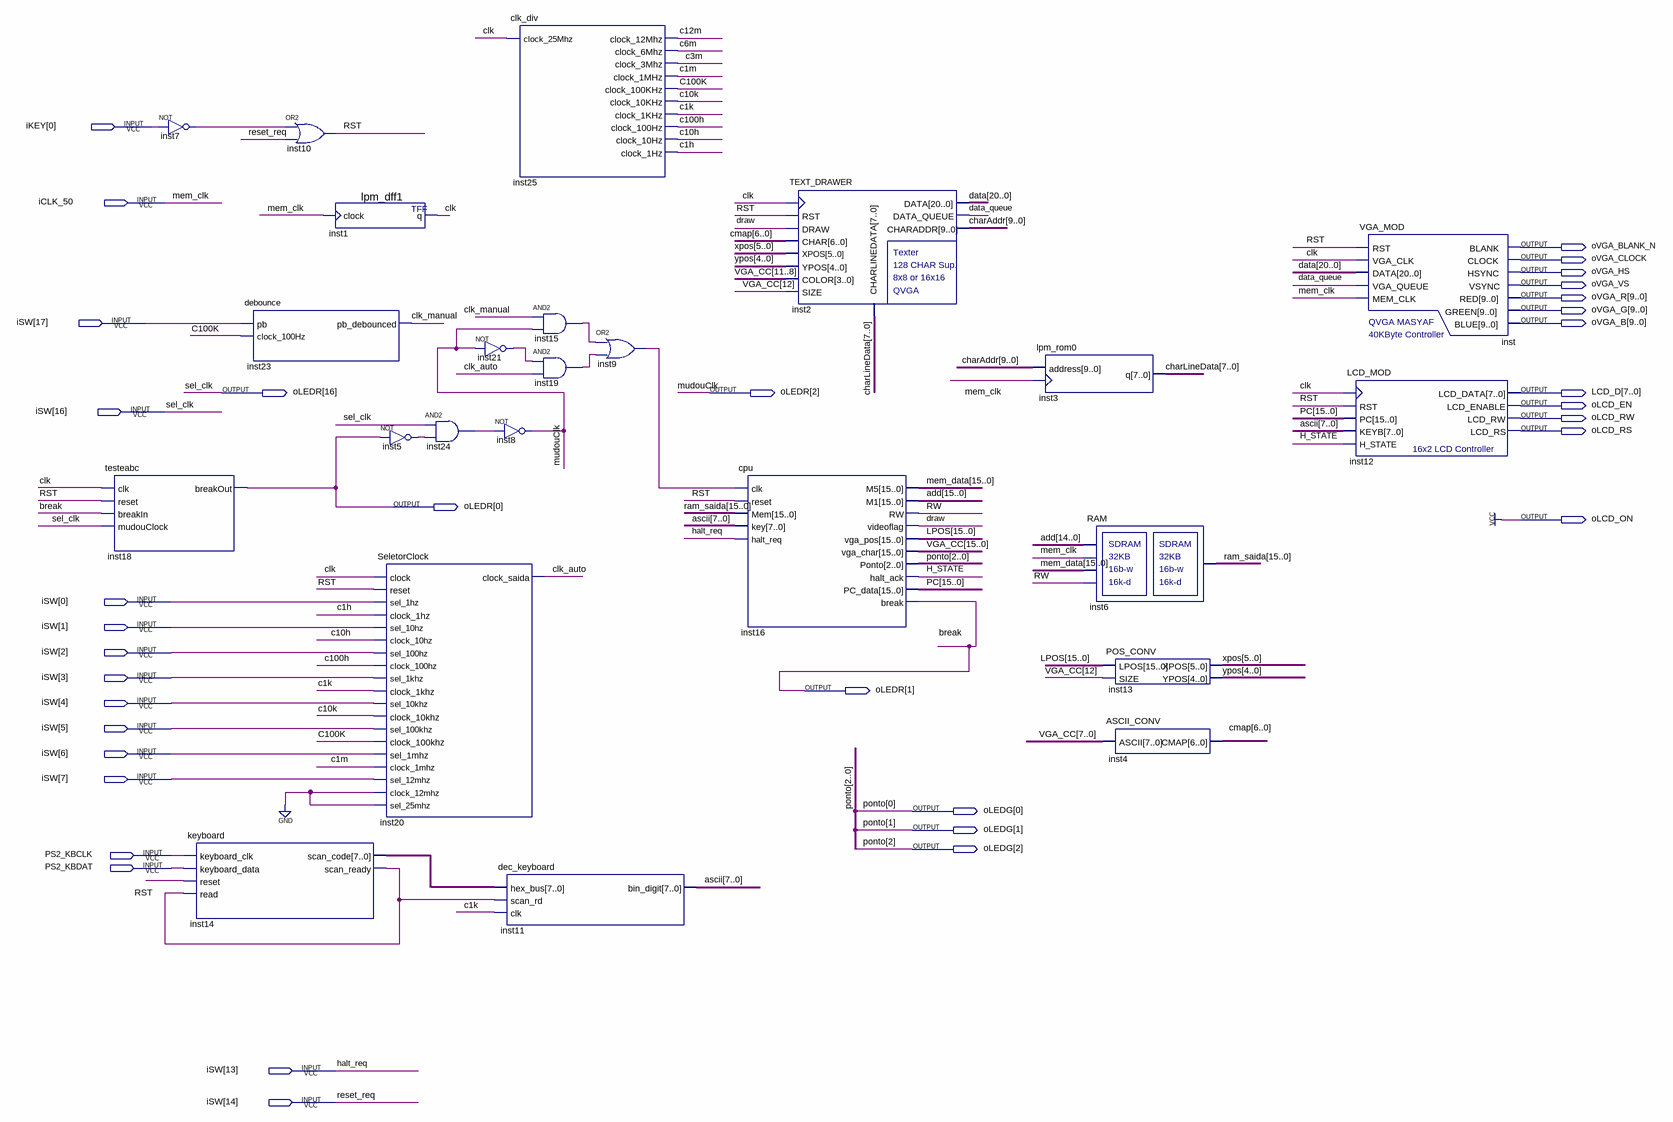
[diagram p0: schematic sheet]
// Quartus schematic AP9.bdf as structural Verilog: 24 symbols, 35 pins
module AP9 (
  input  [0:0] iKEY,
  input  iCLK_50,
  input  [17:0] iSW,
  input  PS2_KBCLK,
  input  PS2_KBDAT,
  output oVGA_BLANK_N,
  output oVGA_CLOCK,
  output oVGA_HS,
  output oVGA_VS,
  output [9:0] oVGA_R,
  output [9:0] oVGA_G,
  output [9:0] oVGA_B,
  output [16:0] oLEDR,
  output [7:0] LCD_D,
  output oLCD_EN,
  output oLCD_RW,
  output oLCD_RS,
  output oLCD_ON,
  output [2:0] oLEDG
);

  wire c1h, c1k, c1m, c3m, c6m, c10h, c10k, c12m, c100h, C100K, clk, clk_auto, clk_manual, data_queue, draw,
       H_STATE, inst5_out, inst7_out, inst9_out, inst14_scan_ready, inst15_out, inst19_out, inst21_out,
       inst24_out, RST, RW;
  wire [4:0] ypos;
  wire [5:0] xpos;
  wire [6:0] cmap;
  wire [7:0] ascii, charLineData, inst14_scan_code;
  wire [9:0] charAddr;
  wire [15:0] add, LPOS, mem_data, PC, ram_saida, VGA_CC;
  wire [20:0] data;

  testeabc inst18 (.clk(clk), .reset(RST), .breakIn(oLEDR[1]), .mudouClock(iSW[16]), .breakOut(oLEDR[0]));
  not inst7 (inst7_out, iKEY[0]);
  keyboard inst14 (
    .keyboard_clk(PS2_KBCLK), .keyboard_data(PS2_KBDAT), .reset(RST), .read(inst14_scan_ready),
    .scan_code(inst14_scan_code), .scan_ready(inst14_scan_ready));
  debounce inst23 (.pb(iSW[17]), .clock_100Hz(C100K), .pb_debounced(clk_manual));
  or inst10 (RST, inst7_out, iSW[14]);
  lpm_dff1 inst1 (.clock(iCLK_50), .q(clk));
  not inst5 (inst5_out, oLEDR[0]);
  SeletorClock inst20 (
    .clock(clk), .reset(RST), .sel_1hz(iSW[0]), .clock_1hz(c1h), .sel_10hz(iSW[1]), .clock_10hz(c10h),
    .sel_100hz(iSW[2]), .clock_100hz(c100h), .sel_1khz(iSW[3]), .clock_1khz(c1k), .sel_10khz(iSW[4]),
    .clock_10khz(c10k), .sel_100khz(iSW[5]), .clock_100khz(C100K), .sel_1mhz(iSW[6]), .clock_1mhz(c1m),
    .sel_12mhz(iSW[7]), .clock_12mhz(1'b0), .sel_25mhz(1'b0), .clock_saida(clk_auto));
  and inst24 (inst24_out, iSW[16], inst5_out);
  clk_div inst25 (
    .clock_25Mhz(clk), .clock_12Mhz(c12m), .clock_6Mhz(c6m), .clock_3Mhz(c3m), .clock_1MHz(c1m),
    .clock_100KHz(C100K), .clock_10KHz(c10k), .clock_1KHz(c1k), .clock_100Hz(c100h), .clock_10Hz(c10h),
    .clock_1Hz(c1h));
  not inst21 (inst21_out, oLEDR[2]);
  not inst8 (oLEDR[2], inst24_out);
  dec_keyboard inst11 (.hex_bus(inst14_scan_code), .scan_rd(inst14_scan_ready), .clk(c1k), .bin_digit(ascii));
  and inst15 (inst15_out, clk_manual, oLEDR[2]);
  and inst19 (inst19_out, inst21_out, clk_auto);
  or inst9 (inst9_out, inst15_out, inst19_out);
  cpu inst16 (
    .clk(inst9_out), .reset(RST), .Mem(ram_saida), .key(ascii), .halt_req(iSW[13]), .M5(mem_data), .M1(add),
    .RW(RW), .videoflag(draw), .vga_pos(LPOS), .vga_char(VGA_CC), .Ponto(oLEDG), .halt_ack(H_STATE),
    .PC_data(PC), .\break (oLEDR[1]));
  TEXT_DRAWER inst2 (
    .RST(RST), .DRAW(draw), .XPOS(xpos), .YPOS(ypos), .COLOR(VGA_CC[11:8]), .SIZE(VGA_CC[12]),
    .CHARLINEDATA(charLineData), .CLK(clk), .CHAR(cmap), .DATA(data), .DATA_QUEUE(data_queue),
    .CHARADDR(charAddr));
  lpm_rom0 inst3 (.clock(iCLK_50), .address(charAddr), .q(charLineData));
  RAM inst6 (.clock(iCLK_50), .data(mem_data), .wren(RW), .address(add[14:0]), .q(ram_saida));
  POS_CONV inst13 (.LPOS(LPOS), .SIZE(VGA_CC[12]), .XPOS(xpos), .YPOS(ypos));
  ASCII_CONV inst4 (.ASCII(VGA_CC[7:0]), .CMAP(cmap));
  VGA_MOD inst (
    .RST(RST), .VGA_CLK(clk), .DATA(data), .VGA_QUEUE(data_queue), .MEM_CLK(iCLK_50), .BLANK(oVGA_BLANK_N),
    .CLOCK(oVGA_CLOCK), .HSYNC(oVGA_HS), .VSYNC(oVGA_VS), .RED(oVGA_R), .GREEN(oVGA_G), .BLUE(oVGA_B));
  LCD_MOD inst12 (
    .RST(RST), .PC(PC), .KEYB(ascii), .H_STATE(H_STATE), .CLK(clk), .LCD_DATA(LCD_D), .LCD_ENABLE(oLCD_EN),
    .LCD_RW(oLCD_RW), .LCD_RS(oLCD_RS));

  assign oLCD_ON = 1'b1;
  assign oLEDR[16] = iSW[16];

  // Other names for the same wires on the sheet: break = oLEDR[1]; halt_req = iSW[13]; mem_clk = iCLK_50;
  //   mudouClk = oLEDR[2]; ponto[2:0] = oLEDG; reset_req = iSW[14]; sel_clk = iSW[16]
endmodule
